# EAGLE design Piezo (EAGLE 9.6.2)
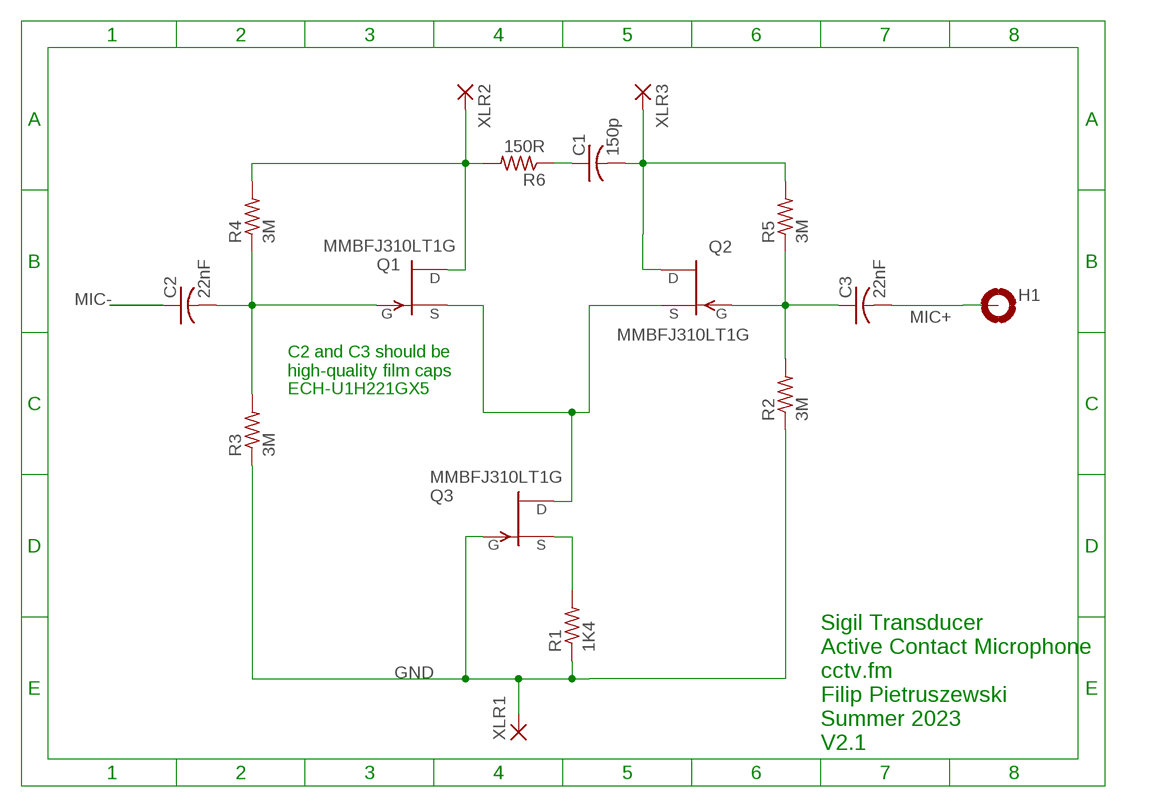
[diagram p0: schematic, sheet 1]

## Parts
C1  150p  C-USC0805  [C0805]
C2  22nF  C-USC1206  [C1206]
C3  22nF  C-USC1206  [C1206]
H1  MOUNT-PAD-ROUND3.6  [3,6-PAD]
Q1  MMBFJ310LT1G  SST201  [SOT23]
Q2  MMBFJ310LT1G  SST201  [SOT23]
Q3  MMBFJ310LT1G  SST201  [SOT23]
R1  1K4  R-US_R0805  [R0805]
R2  3M  R-US_R0805  [R0805]
R3  3M  R-US_R0805  [R0805]
R4  3M  R-US_R0805  [R0805]
R5  3M  R-US_R0805  [R0805]
R6  150R  R-US_R0805  [R0805]
XLR1  DNP  SMD5  [SMD2,54-5,08]
XLR2  DNP  SMD5  [SMD2,54-5,08]
XLR3  DNP  SMD5  [SMD2,54-5,08]

## Nets
GND: Q3.3(G) R1.1 R2.1 R3.1 XLR1.1(P)
MIC+: C3.2 H1.B3,6(MOUNT)
MIC-: C2.1
N$1: Q1.2(S) Q2.2(S) Q3.1(D)
N$2: C2.2 Q1.3(G) R3.2 R4.1
N$3: C3.1 Q2.3(G) R2.2 R5.1
N$4: Q1.1(D) R4.2 R6.2 XLR2.1(P)
N$5: Q3.2(S) R1.2
N$7: C1.1 R6.1
N$8: C1.2 Q2.1(D) R5.2 XLR3.1(P)

## Notes on the sheet
- C2 and C3 should be
  high-quality film caps
- ECH-U1H221GX5
- Sigil Transducer
  Active Contact Microphone
  cctv.fm
  Filip Pietruszewski
  Summer 2023
  V2.1

## Library data of the parts
C1-C3 = rcl:C-US: CAPACITOR, American symbol; SPICEPREFIX: C
H1 = holes:MOUNT-PAD-ROUND: MOUNTING PAD, round
Q1-Q3 = transistor-fet:?20*: TEMIC / Siliconix N-Channel JFET Source: JFET-J201_Siliconix_data.pdf
R1-R6 = rcl:R-US_: RESISTOR, American symbol; SPICEPREFIX: R
XLR1-XLR3 = wirepad:SMD5: SMD PAD

## Net classes
0 default: width 0.406 mm, drill 0.406 mm, clearance 0.406 mm

## Board
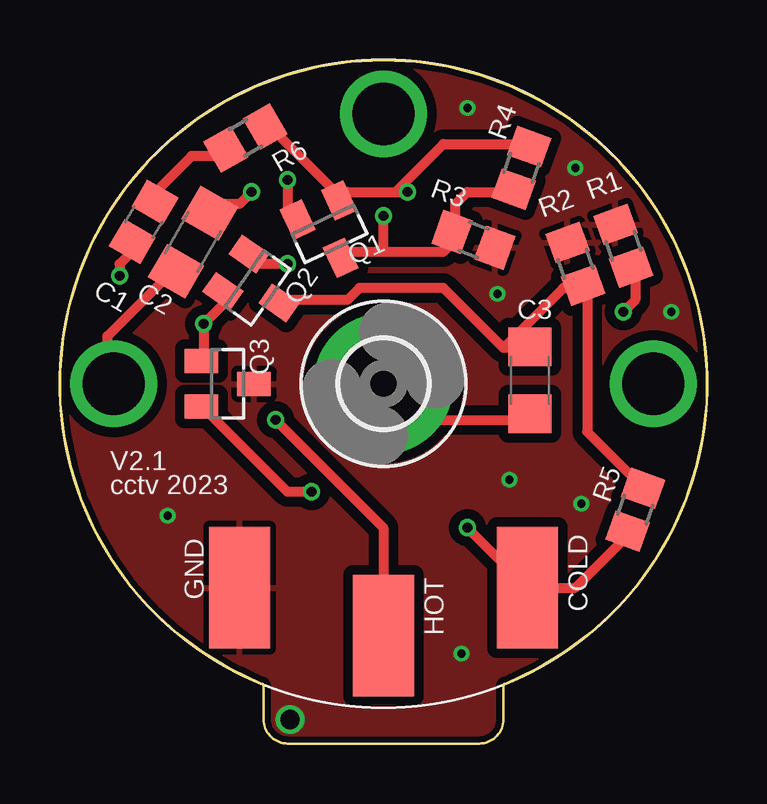
[diagram p1: board, top side]
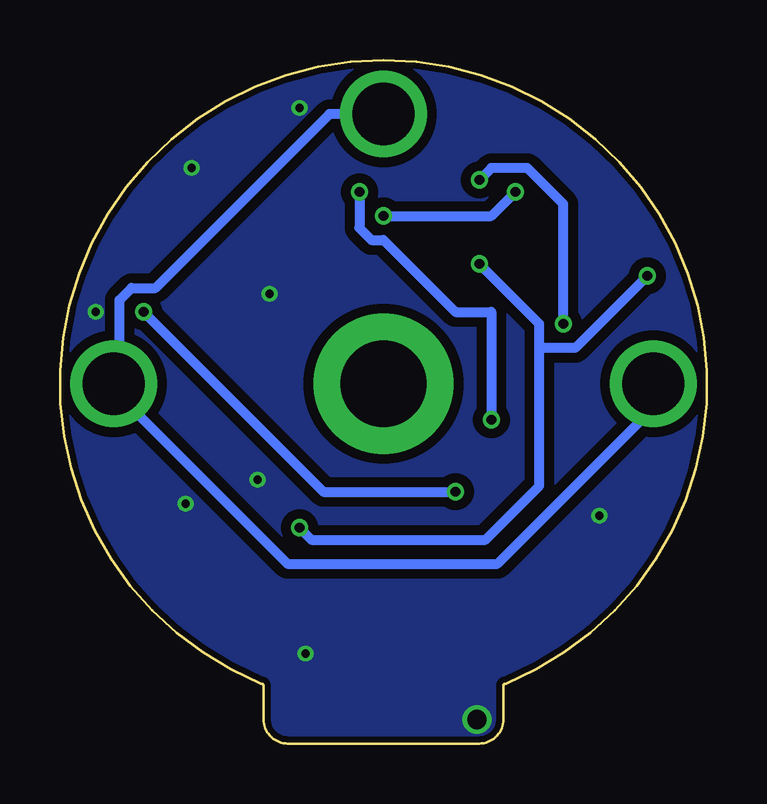
[diagram p2: board, bottom side, seen from below]

Size 26.98 x 28.5 mm. Coordinates in mm from the lower left corner, seen from the top.
Outline: 13.49,0 9.49,0 arc-90 8.49,1 8.49,2 8.49,2.4 arc90 8.39,2.5 arc-316 18.59,2.5 arc90 18.49,2.4 18.49,2 18.49,1 arc-90 17.49,0 13.49,0
Copper layers (1*16): Top 0.035mm / dielectric 1.5mm / Bottom 0.035mm
Design rules "dirt_cheap_dirty_boards.v1": minimum track width 5mil, minimum drill 12mil, track to track 5mil, track to pad 5mil, pad to pad 5mil, via to via 5mil, smd to smd 0mil, copper to edge 10mil, drill to drill 10mil, minimum pad ring 10mil, minimum via ring 6mil, stop-mask expansion 2mil, vias tented up to drill 25mil, thermal gap 10mil

### Footprints (pad centres in the part's own frame; a part is rotated, then mirrored left to right if it is on the bottom)
C0805 = smd 1.3 x 1.5: 1 -0.95,0; 2 0.95,0
C1206 = smd 1.6 x 1.8: 1 -1.4,0; 2 1.4,0
3,6-PAD = drill 3.6 pad 5.842: B3,6 0,0
SOT23 = smd 1 x 1.4: 1 -0.95,-1.1; 2 0.95,-1.1; 3 0,1.1
R0805 = smd 1.3 x 1.5: 1 -0.95,0; 2 0.95,0
SMD2,54-5,08 = smd 2.54 x 5.08: 1 0,0

### Placement (x,y rotation side)
C1  3.49,21.75 240 top
C2  5.54,20.9 60 top
C3  19.59,15.15 270 top
H1  13.49,15 0 top
Q1  11.24,21.25 205 top
Q2  8.24,19 235 top
Q3  6.99,15 270 top
R1  23.49,20.75 290 top
R2  21.49,20 290 top
R3  17.24,21 160 top
R4  19.24,24 70 top
R5  23.99,9.75 250 top
R6  7.74,25.25 30 top
XLR1  7.49,6.5 0 top
XLR2  13.49,4.5 0 top
XLR3  19.49,6.5 0 top

### Tracks (layer width: path | path; a pad name or v marks a point on that pad's centre or on a via)
GND  (via drill 0.35, 0.8)
  other vias: 4.49,9.5 18.74,11 18.24,18.75 21.49,24 25.49,18 16.74,3.75 21.74,10 16.99,26.5 9.59,1
  pour Top: -0.01,15.25 arc-90 13.24,28.5 arc-90 26.99,14.75 arc-90 13.74,1.5 arc-90
  pour Bottom: -0.01,15.25 arc-90 13.24,28.5 arc-90 26.99,14.75 arc-90 13.74,1.5 arc-90
  pour Top: 18.49,3.1 18.49,1 arc-90 17.49,0 9.39,0 arc-90 8.39,1 8.39,3 arc-90 8.49,3.1
  pour Bottom: 18.49,3.1 18.49,1 arc-90 17.49,0 9.49,0 arc-90 8.49,1 8.49,3 arc-90 8.59,3.1
MIC+
  Top 0.406: H1.B3,6 14.99,13.5 19.49,13.5 C3.2
MIC-  (via drill 2.6)
  Top 0.406: C2.1 4.49,19.5 1.99,17 1.99,15 v2.24,15
  Bottom 0.406: v13.49,26.25 15.74,26.25 22.99,19 23.99,19 24.49,18.5 24.49,15 v24.74,15 24.99,15 17.49,7.5 8.74,7.5 2.24,14 v2.24,15
N$1  (via drill 0.41)
  Top 0.406: Q3.1 5.99,16 v5.99,17.5 6.99,18.5 Q2.2 | v9.49,23.5 9.49,22 Q1.2
  Bottom 0.406: v9.49,23.5 8.99,24 7.49,24 5.99,22.5 v5.99,17.5
N$2  (via drill 0.41)
  Top 0.406: 13.49,20.5 15.99,20.5 16.49,21 R3.2 16.49,21.5 16.49,22.5 16.99,23 18.49,23 R4.1 | 13.49,20.5 11.99,20.5 Q1.3 | v7.99,23 7.49,22.5 6.49,22.5 C2.2 | 13.49,20.5 v13.49,22
  Bottom 0.406: v7.99,23 8.99,22 v13.49,22
N$3
  Top 0.406: 18.49,16.5 15.99,19 12.49,19 11.99,18.5 9.49,18.5 Q2.3 | 18.49,16.5 19.49,16.5 C3.1 | 18.49,16.5 20.99,19 21.49,19 R2.2 21.99,19 21.99,13 23.99,11 R5.1
N$4  (via drill 0.41)
  Top 0.406: R6.2 8.99,25.5 11.49,23 Q1.1 11.99,23 13.99,23 | 13.99,23 15.99,25 19.49,25 R4.2 | XLR2.1 13.49,9 v8.99,13.5 | 13.99,23 v14.49,23
  Bottom 0.406: v8.99,13.5 8.99,18 10.49,18 13.49,21 13.99,21 14.49,21.5 v14.49,23
N$5  (via drill 0.41)
  Top 0.406: v10.49,10.5 9.49,10.5 5.99,14 Q3.2 | v23.49,18 23.99,18.5 23.99,19.5 R1.2
  Bottom 0.406: v10.49,10.5 15.99,10.5 v23.49,18
N$7
  Top 0.406: C1.1 3.99,23 5.49,24.5 6.49,24.5 R6.1
N$8  (via drill 0.41)
  Top 0.406: v9.49,20 7.99,20 Q2.1 | v2.49,19.5 2.49,20 2.99,20.5 C1.2 | R5.2 23.49,8.5 21.49,6.5 XLR3.1 v16.99,9
  Bottom 0.406: v9.49,20 6.99,17.5 6.99,16.5 | 6.99,16.5 5.49,16.5 v2.49,19.5 | 6.99,16.5 6.99,10.75 9.24,8.5 16.49,8.5 v16.99,9

### Text on the board
tNames: V2.1 | cctv 2023 | GND | COLD | HOT